# EAGLE design ampinv (EAGLE 8.5.1)
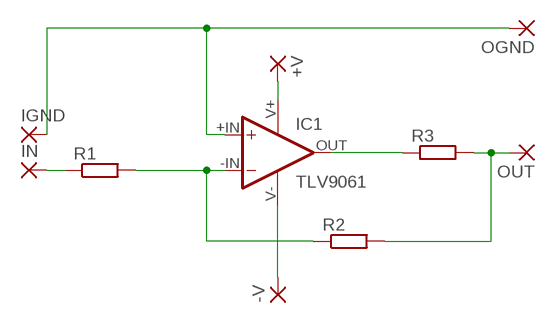
[diagram p0: schematic, sheet 1]

## Parts
+V  SMD2  [SMD1,27-2,54]
-V  SMD2  [SMD1,27-2,54]
IC1  TLV9061  [TLV9061]
IGND  SMD2  [SMD1,27-2,54]
IN  SMD2  [SMD1,27-2,54]
OGND  SMD2  [SMD1,27-2,54]
OUT  SMD2  [SMD1,27-2,54]
R1  R-EU_R0402  [R0402]
R2  R-EU_R0402  [R0402]
R3  R-EU_R0402  [R0402]

## Nets
GND: IC1.+IN IGND.1(P) OGND.1(P)
N$2: IC1.-IN R1.2 R2.1
N$3: IC1.OUT R3.1
N$4: OUT.1(P) R2.2 R3.2
N$5: -V.1(P) IC1.V-
N$6: +V.1(P) IC1.V+
N$9: IN.1(P) R1.1

## Library data of the parts
+V -V IGND IN OGND OUT = wirepad:SMD2: SMD PAD
IC1 = Texas OpAmp:TLV9061
R1-R3 = resistor:R-EU_: RESISTOR, European symbol

## Board
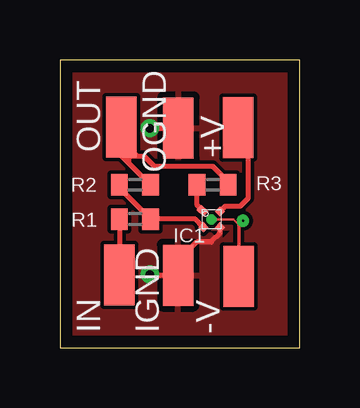
[diagram p1: board, top side]
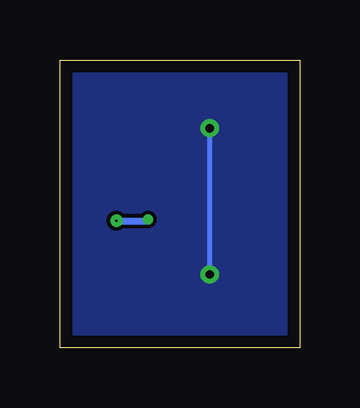
[diagram p2: board, bottom side, seen from below]

Size 10 x 12 mm. Coordinates in mm from the lower left corner, seen from the top.
Outline: 0,0 10,0 10,12 0,12 0,0
Copper layers (1*16): Top 0.035mm / dielectric 1.5mm / Bottom 0.035mm
Design rules "default *": minimum track width 6mil, minimum drill 0.35mm, track to track 6mil, track to pad 6mil, pad to pad 6mil, via to via 6mil, smd to smd 6mil, copper to edge 20mil, drill to drill 6mil, minimum pad ring 10mil, minimum via ring 8mil, stop-mask expansion 4mil, vias tented up to drill 0mil, thermal gap 10mil

### Footprints (pad centres in the part's own frame; a part is rotated, then mirrored left to right if it is on the bottom)
SMD1,27-2,54 = smd 1.27 x 2.54: 1 0,0
TLV9061 = smd 0.3 x 0.3 rotated 225: +IN 0.36,-0.32 | smd 0.3 x 0.3 rotated 135: -IN -0.33,-0.32 | smd 0.3 x 0.4 rotated 45: OUT -0.37,0.37 | smd 0.3 x 0.3 rotated 315: V+ 0.36,0.34 | smd 0.3 x 0.3 rotated 45: V- 0,0
R0402 = smd 0.7 x 0.9: 1 -0.65,0; 2 0.65,0

### Placement (x,y rotation side)
+V  7.44,9.17 0 top
-V  7.46,2.97 0 top
IC1  6.32,5.34 0 top
IGND  4.93,3.02 0 top
IN  2.48,3.03 0 top
OGND  4.94,9.16 0 top
OUT  2.56,9.19 0 top
R1  3.13,5.36 0 top
R2  3.13,6.79 0 top
R3  6.37,6.79 0 top

### Tracks (layer width: path | path; a pad name or v marks a point on that pad's centre or on a via)
GND  (via drill 0.35)
  Top 0.2: 6.68,4.77 6.31,4.4 5.7,4.4 4.93,3.63 IGND.1 3.83,3.02 v3.75,3.05 | v3.75,9.15 v3.76,9.16 OGND.1
  Top 0.203: IGND.1 4.95,3.04 | IC1.+IN 6.68,4.77
  Bottom 0.2: v3.75,3.05 v3.75,9.15
  pour Bottom: -0.3,12.25 10.3,12.25 10.3,-0.2 10.25,-0.25 -0.35,-0.25 -0.35,12.25 -0.3,12.3
  pour Top: -0.35,12.4 10.6,12.45 10.6,-0.25 10.55,-0.3 -0.25,-0.3 -0.35,-0.2
N$1  (via drill 0.01 pad 0.3)
  other vias: 6.32,5.34
N$2
  Top 0.203: IC1.-IN 5.65,5.36 R1.2 2.48,6.66 R2.1
N$3
  Top 0.203: IC1.OUT 5.72,5.94 R3.1
N$4
  Top 0.2: R2.2 2.87,7.7 | 2.87,7.7 2.78,7.79 | 2.78,7.79 2.56,8.01 2.56,8.44 | 6.38,7.56 3.94,7.56 3.53,7.97 3.24,7.97 | 3.24,7.97 2.96,7.97 2.87,7.88 | 2.87,7.88 2.78,7.79 | OUT.1 2.56,8.65 3.24,7.97 | 2.87,7.88 2.87,7.7
  Top 0.203: R3.2 6.77,7.17 6.38,7.56 | 2.56,8.44 OUT.1
N$5  (via drill 0.1 pad 0.3)
  Top 0.1: IC1.V- 7.23,5.34 7.46,5.11
  Top 0.152: -V.1 7.46,5.11 v7.64,5.29
  Bottom 0.3: v7.64,5.29 6.37,5.29
N$6
  Top 0.203: IC1.V+ 6.9,5.9 7.53,5.9 7.86,6.23 7.86,8.23 7.44,8.65 +V.1
N$9
  Top 0.203: R1.1 IN.1

### Text on the board
tNames: IC1